# Altium schematic sheet MCU.SchDoc: MCU STM32H750VBT
size A3; Author: Ahmad Banshee; DrawnBy: Ahmad Banshee
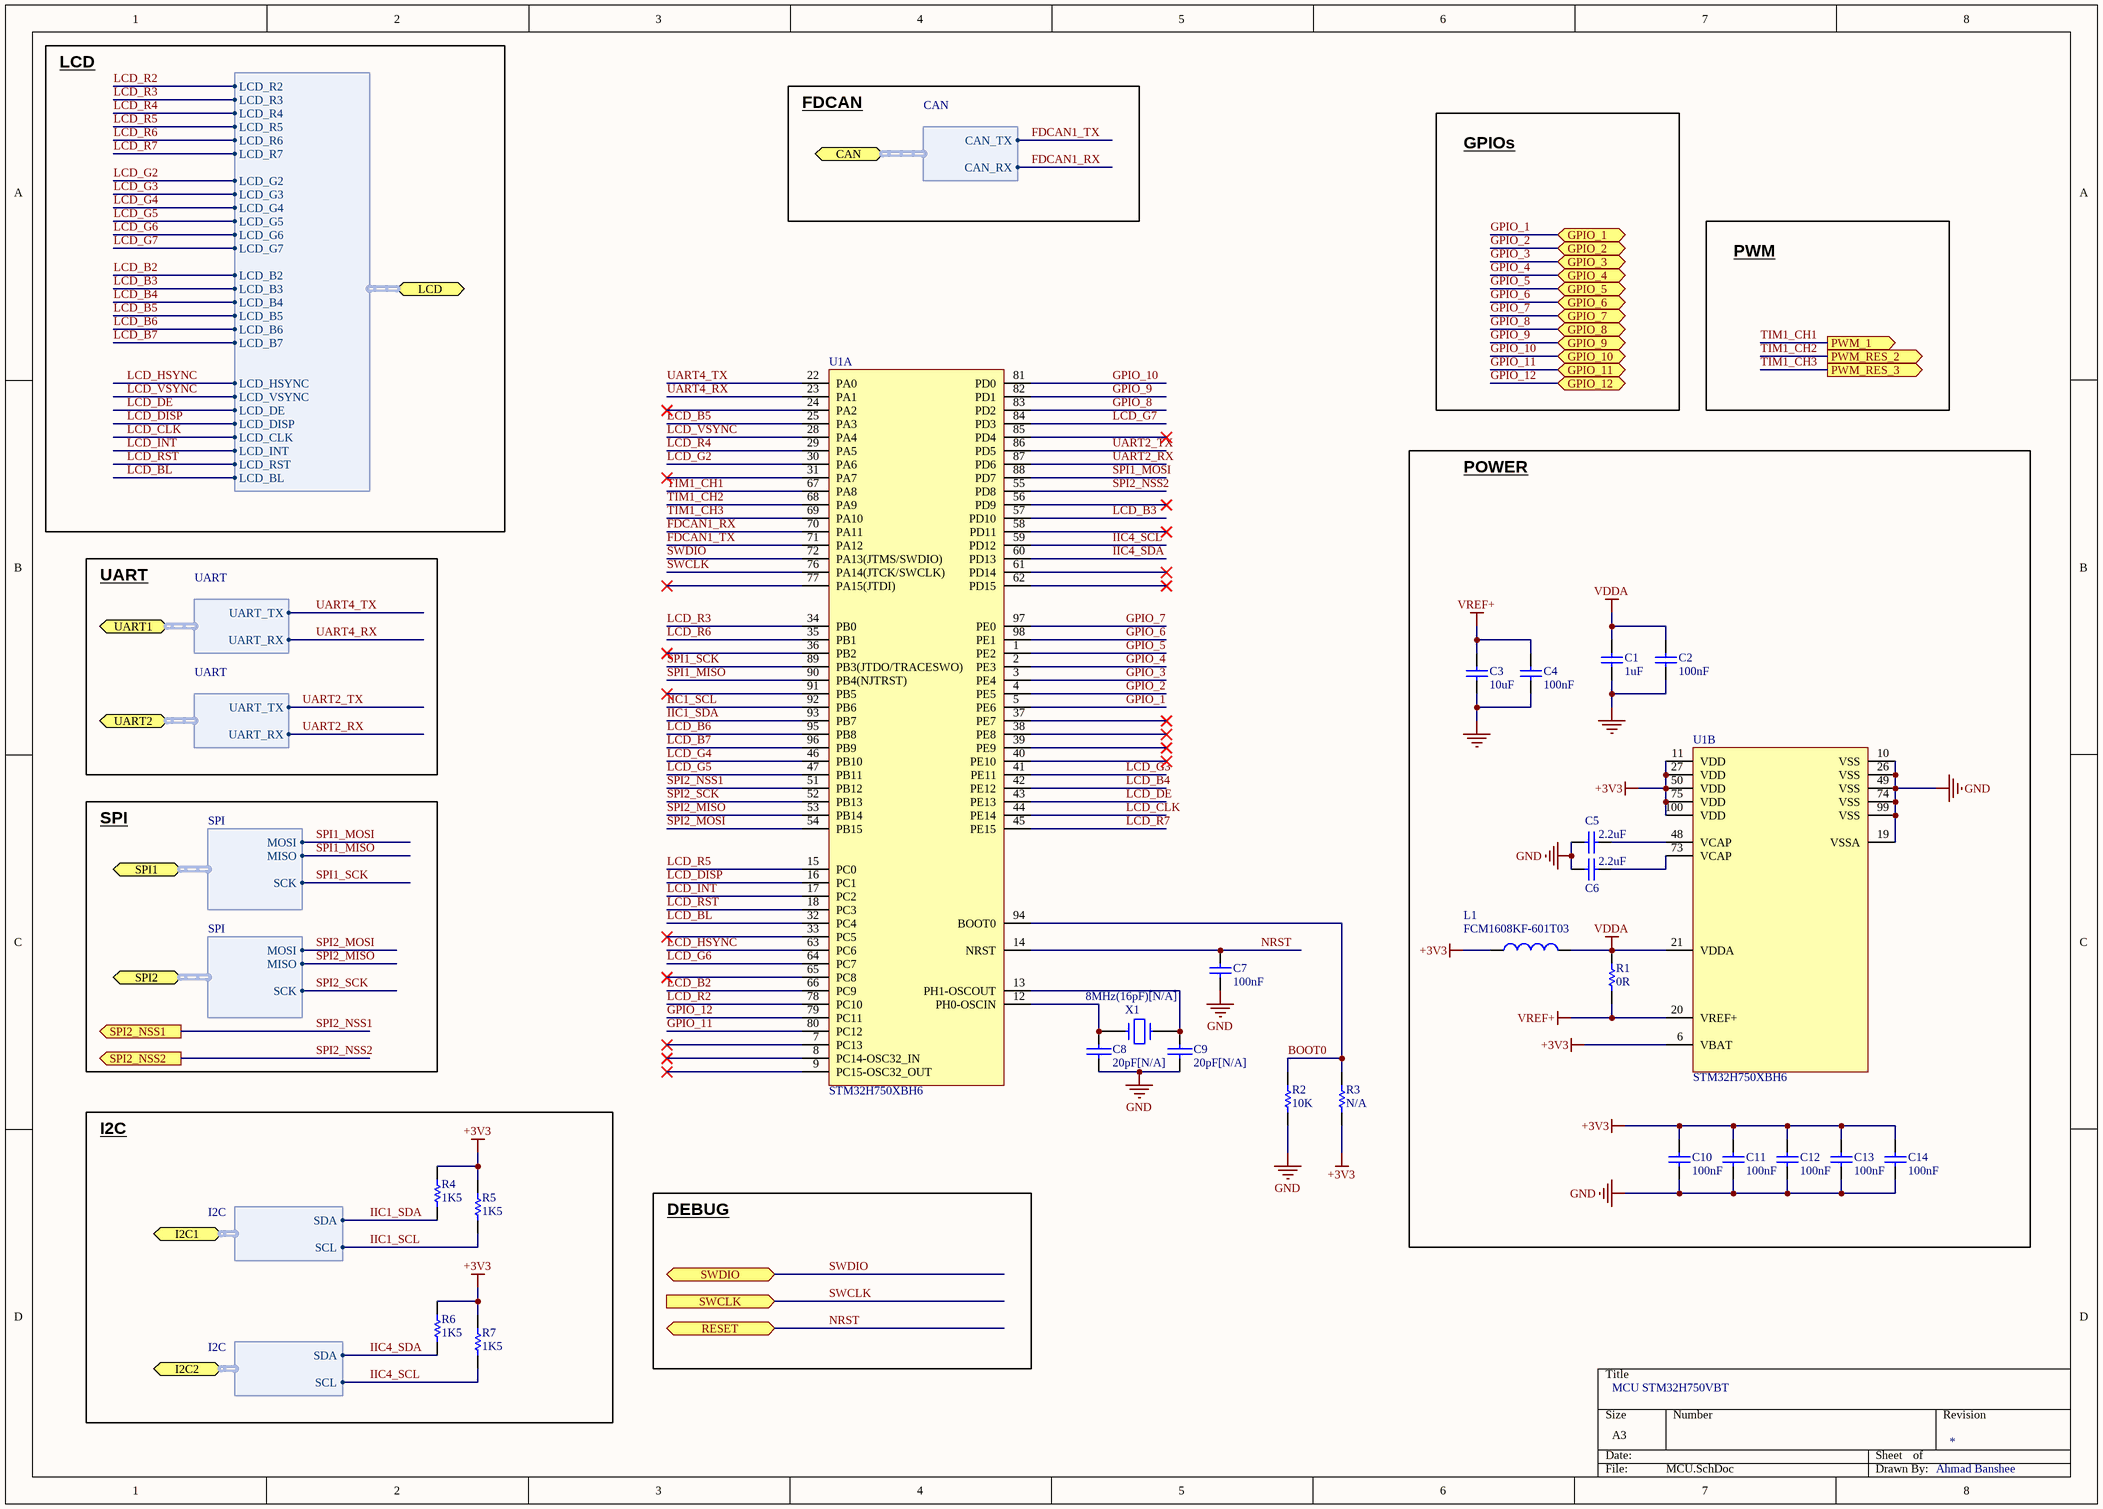
[diagram p0: MCU.SchDoc]

## Parts
C1  value 1uF  [0805C-ST]  (hidden comment: Capacitor)
C2  value 100nF  [0603C ST]  (hidden comment: Capacitor)
C3  value 10uF  [0805C-ST]  (hidden comment: Capacitor)
C4  value 100nF  [0603C ST]  (hidden comment: Capacitor)
C5  value 2.2uF  [0603C-ST]  (hidden comment: Capacitor)
C6  value 2.2uF  [0603C-ST]  (hidden comment: Capacitor)
C7  100nF  [0603C ST]
C8  20pF[N/A]  [0603C ST]
C9  20pF[N/A]  [0603C ST]
C10  value 100nF  [0603C ST]  (hidden comment: Capacitor)
C11  value 100nF  [0603C ST]  (hidden comment: Capacitor)
C12  value 100nF  [0603C ST]  (hidden comment: Capacitor)
C13  value 100nF  [0603C ST]  (hidden comment: Capacitor)
C14  value 100nF  [0603C ST]  (hidden comment: Capacitor)
L1  Manufacturer_Part_Number: FCM1608KF-601T03  [0603L-ST]  (hidden comment: BEAD)
R1  value 0R  [0603R]  (hidden comment: Resistor)
R2  value 10K  [0603R]  (hidden comment: Resistor)
R3  N/A  [0603R]
R4  value 1K5  [0603R]  (hidden comment: Resistor)
R5  value 1K5  [0603R]  (hidden comment: Resistor)
R6  value 1K5  [0603R]  (hidden comment: Resistor)
R7  value 1K5  [0603R]  (hidden comment: Resistor)
U1  value STM32H750XBH6  [LQFP100_M]  (parts A,B of 2)
X1  8MHz(16pF)[N/A]  [XTAL1]

## Blocks framed on the sheet
POWER: C1-C6 C10-C14 L1 R1 U1
I2C: R4-R7

## Ports
CAN (harness CAN), GPIO_1, GPIO_2, GPIO_3, GPIO_4, GPIO_5, GPIO_6, GPIO_7, GPIO_8, GPIO_9, GPIO_10, GPIO_11, GPIO_12, I2C1 (harness I2C), I2C2 (harness I2C), LCD (harness LCD), PWM_1 (out), PWM_RES_2 (out), PWM_RES_3 (out), RESET, SPI1 (harness SPI), SPI2 (harness SPI), SPI2_NSS1 (out), SPI2_NSS2 (out), SWCLK (in), SWDIO (bidir), UART1 (harness UART), UART2 (harness UART)

## Harnesses
I2C: SDA, SCL
UART: UART_TX, UART_RX
SPI: MOSI, MISO, SCK
CAN: CAN_TX, CAN_RX
LCD: LCD_R2, LCD_G2, LCD_B2, LCD_HSYNC, LCD_VSYNC, LCD_DE, LCD_DISP, LCD_CLK, LCD_INT, LCD_BL, LCD_RST, LCD_R3, LCD_R4, LCD_R5, LCD_R6, LCD_R7, LCD_G3, LCD_G4, LCD_G5, LCD_G6, LCD_G7, LCD_B3, LCD_B4, LCD_B5, LCD_B6, LCD_B7

## Nets
+3V3: C10.2 C11.2 C12.2 C13.2 C14.2 L1.1 R3.1 R4.2 R5.2 R6.2 R7.2 U1.6(VBAT) U1.11(VDD) U1.27(VDD) U1.50(VDD) U1.75(VDD) U1.100(VDD)
GND: C1.1 C2.1 C3.1 C4.1 C5.1 C6.1 C7.2 C8.1 C9.1 C10.1 C11.1 C12.1 C13.1 C14.1 R2.2 U1.10(VSS) U1.19(VSSA) U1.26(VSS) U1.49(VSS) U1.74(VSS) U1.99(VSS)
VDDA: C1.2 C2.2 L1.2 R1.1 U1.21(VDDA)
VREF+: C3.2 C4.2 R1.2 U1.20(VREF+)
BOOT0: R2.1 R3.2 U1.94(BOOT0)
FDCAN1_RX: U1.70(PA11) ; port CAN.CAN_RX
FDCAN1_TX: U1.71(PA12) ; port CAN.CAN_TX
GPIO_1: U1.5(PE6) ; port GPIO_1
GPIO_2: U1.4(PE5) ; port GPIO_2
GPIO_3: U1.3(PE4) ; port GPIO_3
GPIO_4: U1.2(PE3) ; port GPIO_4
GPIO_5: U1.1(PE2) ; port GPIO_5
GPIO_6: U1.98(PE1) ; port GPIO_6
GPIO_7: U1.97(PE0) ; port GPIO_7
GPIO_8: U1.83(PD2) ; port GPIO_8
GPIO_9: U1.82(PD1) ; port GPIO_9
GPIO_10: U1.81(PD0) ; port GPIO_10
GPIO_11: U1.80(PC12) ; port GPIO_11
GPIO_12: U1.79(PC11) ; port GPIO_12
IIC1_SCL: R5.1 U1.92(PB6) ; port I2C1.SCL
IIC1_SDA: R4.1 U1.93(PB7) ; port I2C1.SDA
IIC4_SCL: R7.1 U1.59(PD12) ; port I2C2.SCL
IIC4_SDA: R6.1 U1.60(PD13) ; port I2C2.SDA
LCD_B2: U1.66(PC9) ; port LCD.LCD_B2
LCD_B3: U1.57(PD10) ; port LCD.LCD_B3
LCD_B4: U1.42(PE12) ; port LCD.LCD_B4
LCD_B5: U1.25(PA3) ; port LCD.LCD_B5
LCD_B6: U1.95(PB8) ; port LCD.LCD_B6
LCD_B7: U1.96(PB9) ; port LCD.LCD_B7
LCD_BL: U1.32(PC4) ; port LCD.LCD_BL
LCD_CLK: U1.44(PE14) ; port LCD.LCD_CLK
LCD_DE: U1.43(PE13) ; port LCD.LCD_DE
LCD_DISP: U1.16(PC1) ; port LCD.LCD_DISP
LCD_G2: U1.30(PA6) ; port LCD.LCD_G2
LCD_G3: U1.41(PE11) ; port LCD.LCD_G3
LCD_G4: U1.46(PB10) ; port LCD.LCD_G4
LCD_G5: U1.47(PB11) ; port LCD.LCD_G5
LCD_G6: U1.64(PC7) ; port LCD.LCD_G6
LCD_G7: U1.84(PD3) ; port LCD.LCD_G7
LCD_HSYNC: U1.63(PC6) ; port LCD.LCD_HSYNC
LCD_INT: U1.17(PC2) ; port LCD.LCD_INT
LCD_R2: U1.78(PC10) ; port LCD.LCD_R2
LCD_R3: U1.34(PB0) ; port LCD.LCD_R3
LCD_R4: U1.29(PA5) ; port LCD.LCD_R4
LCD_R5: U1.15(PC0) ; port LCD.LCD_R5
LCD_R6: U1.35(PB1) ; port LCD.LCD_R6
LCD_R7: U1.45(PE15) ; port LCD.LCD_R7
LCD_RST: U1.18(PC3) ; port LCD.LCD_RST
LCD_VSYNC: U1.28(PA4) ; port LCD.LCD_VSYNC
NRST: C7.1 U1.14(NRST) ; port RESET
SPI1_MISO: U1.90(PB4(NJTRST)) ; port SPI1.MISO
SPI1_MOSI: U1.88(PD7) ; port SPI1.MOSI
SPI1_SCK: U1.89(PB3(JTDO/TRACESWO)) ; port SPI1.SCK
SPI2_MISO: U1.53(PB14) ; port SPI2.MISO
SPI2_MOSI: U1.54(PB15) ; port SPI2.MOSI
SPI2_NSS1: U1.51(PB12) ; port SPI2_NSS1
SPI2_NSS2: U1.55(PD8) ; port SPI2_NSS2
SPI2_SCK: U1.52(PB13) ; port SPI2.SCK
SWCLK: U1.76(PA14(JTCK/SWCLK)) ; port SWCLK
SWDIO: U1.72(PA13(JTMS/SWDIO)) ; port SWDIO
TIM1_CH1: U1.67(PA8) ; port PWM_1
TIM1_CH2: U1.68(PA9) ; port PWM_RES_2
TIM1_CH3: U1.69(PA10) ; port PWM_RES_3
UART2_RX: U1.87(PD6) ; port UART2.UART_RX
UART2_TX: U1.86(PD5) ; port UART2.UART_TX
UART4_RX: U1.23(PA1) ; port UART1.UART_RX
UART4_TX: U1.22(PA0) ; port UART1.UART_TX
NetC5_2: C5.2 U1.48(VCAP)
NetC6_2: C6.2 U1.73(VCAP)
NetC8_2: C8.2 U1.12(PH0-OSCIN) X1.1
NetC9_2: C9.2 U1.13(PH1-OSCOUT) X1.2

Not connected (* = marked no-connect by the designer): U1 7(PC13)* 8(PC14-OSC32_IN)* 9(PC15-OSC32_OUT)* 24(PA2)* 31(PA7)* 33(PC5)* 36(PB2)* 37(PE7)* 38(PE8)* 39(PE9)* 40(PE10)* 56(PD9)* 58(PD11)* 61(PD14)* 62(PD15)* 65(PC8)* 77(PA15(JTDI))* 85(PD4)* 91(PB5)*

## Notes on the sheet
- LCD
- FDCAN
- GPIOs
- PWM
- UART
- SPI
- DEBUG

## Library data of the parts
C1 C3 = MCD-00014: Capacitor, MLCC, 10uF, 25V, X5R, 10%, 0805, T=0,85mm; Manufacturer_Part_Number: CC0805KRX5R8BB106; Manufacturer: YAGEO; Provided_By: Subcon; Initial_Board_Reference: mb1274; Internal_Part_Number: MCD-00014; ECCN_US: n/a; ECCN_EU: n/a; ComponentLink1Description: Yageo_Capacitor_X5R-series.pdf; Status: Released; Part_Type: Capacitor; Package: C0805; ComponentLink1URL: http://tunmcdsvn.tun.st.com/Component_Datasheet_Library/Trunk/Capacitors/Yageo_Capacitor_X5R-series.pdf
C2 C4 C10-C14 = MCD-00102: Capacitor, MLCC, 100nF, 16V, X7R, 10%, 0402, T=0,5mm; Manufacturer_Part_Number: CC0402KRX7R7BB104; Manufacturer: YAGEO; Provided_By: Subcon; Initial_Board_Reference: MB1262; Internal_Part_Number: MCD-00102; Status: Released; Part_Type: Capacitor; Package: C0402; ComponentLink1Description: Yageo_Capacitor_X7R-series.pdf; ComponentLink1URL: http://tunmcdsvn.tun.st.com/Component_Datasheet_Library/Trunk/Capacitors/Yageo_Multilayer_Capacitor_X7R_series_100pF_to_22uF; ECCN_US: n/a; ECCN_EU: n/a
C5 C6 = MCD-00012: Capacitor, MLCC, 2.2uF, 10V, X5R, 10%, 0603, T=0,8mm; Manufacturer_Part_Number: CC0603KRX5R6BB225; Manufacturer: YAGEO; Alternate_Manufacturer_Part_Number: C0603C225K8PACTU; Alternate_Manufacturer: KEMET; Provided_By: Subcon; Initial_Board_Reference: MB1274; Internal_Part_Number: MCD-00012; Status: Released; Part_Type: Capacitor; Package: C0603; ComponentLink1Description: Yageo_Capacitor_X5R-series.pdf; ComponentLink1URL: http://tunmcdsvn.tun.st.com/Component_Datasheet_Library/Trunk/Capacitors/Yageo_Multilayer_capacitor_X5R_series_100pF_to_100uF; ECCN_US: n/a; ECCN_EU: n/a
C7 = Cap: Capacitor; Value: 10nF; Published: 8-Jun-2000; Revision: July-2002: Re-released for DXP Platform.; Publisher: Altium Limited
C8 C9 = CAP: Capacitor
L1 = MCD-00047: SMD Chip ferrite bead, 600R@100MHz +/-25%, 350mA, 500mohm DC, 0603, T=0.8mm; Part_Type: Inductor; Manufacturer: TAI-TECH; Provided_By: Subcon; Initial_Board_Reference: MB1274; Internal_Part_Number: MCD-00047; Value: 600R@100MHz; Status: Released; ComponentLink1Description: TaiTech_Bead_FCM1608_series.pdf; ComponentLink1URL: http://tunmcdsvn.tun.st.com/Component_Datasheet_Library/Trunk/Inductors/TaiTech_Bead_FCM1608_series; ECCN_US: n/a; ECCN_EU: n/a
R1 = MCD-00181: Resistor,0R,0603,ULO; Manufacturer_Part_Number: PMR03EZPJ000; Manufacturer: ROHM; Provided_By: Subcon; Internal_Part_Number: MCD-00181; Status: Released; Part_Type: Resistor; Package: R0603; ComponentLink1Description: ROHM_ULtra low Ohmic Resistor _PMR10EZPJ000.pdf; ComponentLink1URL: http://tunmcdsvn.tun.st.com/Component_Datasheet_Library/Trunk/Resistors/ROHM_ULtra low Ohmic Resistor _PMR10EZPJ000.pdf; ECCN_US: n/a; ECCN_EU: n/a
R2 R3 = MCD-00053: Resistor,10K,0402,1%,1/16W; Manufacturer_Part_Number: RC0402FR-0710KL; Manufacturer: YAGEO; Provided_By: subcon; Initial_Board_Reference: MB1274; Internal_Part_Number: MCD-00053; Status: Released; Part_Type: Resistor; Package: R0402; ComponentLink1Description: Yageo_Resistor_RC0402-series.pdf; ComponentLink1URL: http://tunmcdsvn.tun.st.com/Component_Datasheet_Library/Trunk/Resistors/Yageo_Resistor_RC0402-series; ECCN_US: n/a; ECCN_EU: n/a
  R3: Value: 10K
R4-R7 = MCD-00068: Resistor,1K5,0402,1%,1/16W; Manufacturer_Part_Number: RC0402FR-071K5L; Manufacturer: YAGEO; Provided_By: Subcon; Initial_Board_Reference: MB1274; Internal_Part_Number: MCD-00068; Status: Released; Part_Type: Resistor; Package: R0402; ComponentLink1Description: Datasheet; ComponentLink1URL: http://tunmcdsvn.tun.st.com/Component_Datasheet_Library/Trunk/Resistors/Yageo_Resistor_RC0402-series
U1 = STM32H750VBT: 32bit MCU TFBGA240+25; Internal_Part_Number: MCD-01085; Part_Type: IC; Manufacturer_Part_Number: STM32H745XIH6; Manufacturer: STMICROELECTRONICS; Provided_By: STM; Initial_Board_Reference: MB1381; Status: Footprint available; Package: TFBGA265; ComponentLink1Description: Datasheet; ComponentLink1URL: http://tunmcdsvn.tun.st.com/Component_Datasheet_Library/Trunk/IC/STM_MCU_STM32H745H6U_TFBGA265/STM_MCU_STM32H745H6U_TFBGA265.pdf
X1 = CRYSTAL